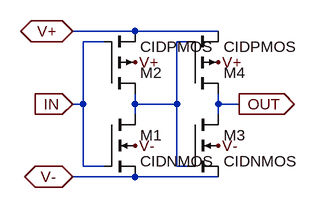
[diagram p0: schematic Buffer.asc]
Buffer.asc, the LTspice schematic file:
Version 4.1
SHEET 1 880 680
WIRE 256 32 160 32
WIRE 384 32 256 32
WIRE 208 48 176 48
WIRE 336 48 320 48
WIRE 176 144 176 48
WIRE 176 144 160 144
WIRE 256 144 256 128
WIRE 320 144 320 48
WIRE 320 144 256 144
WIRE 384 144 384 128
WIRE 416 144 384 144
WIRE 256 160 256 144
WIRE 384 160 384 144
WIRE 176 240 176 144
WIRE 208 240 176 240
WIRE 320 240 320 144
WIRE 336 240 320 240
WIRE 256 256 160 256
WIRE 384 256 256 256
FLAG 160 144 IN
IOPIN 160 144 In
FLAG 416 144 OUT
IOPIN 416 144 Out
FLAG 160 256 V-
IOPIN 160 256 BiDir
FLAG 256 208 V-
FLAG 160 32 V+
IOPIN 160 32 BiDir
FLAG 256 80 V+
FLAG 384 208 V-
FLAG 384 80 V+
SYMBOL nmos4 208 160 R0
SYMATTR InstName M1
SYMATTR Value CIDNMOS
SYMATTR Value2 l=5u w=10u
SYMBOL pmos4 208 128 M180
SYMATTR InstName M2
SYMATTR Value CIDPMOS
SYMATTR Value2 l=5u w=25u
SYMBOL nmos4 336 160 R0
SYMATTR InstName M3
SYMATTR Value CIDNMOS
SYMATTR Value2 l=5u w=10u
SYMBOL pmos4 336 128 M180
SYMATTR InstName M4
SYMATTR Value CIDPMOS
SYMATTR Value2 l=5u w=25u

The netlist it stands for:
* Buffer.asc
M1 N001 IN V- V- CIDNMOS l=5u w=10u
M2 N001 IN V+ V+ CIDPMOS l=5u w=25u
M3 OUT N001 V- V- CIDNMOS l=5u w=10u
M4 OUT N001 V+ V+ CIDPMOS l=5u w=25u
.model NMOS NMOS
.model PMOS PMOS
.lib standard.mos
.backanno
.end